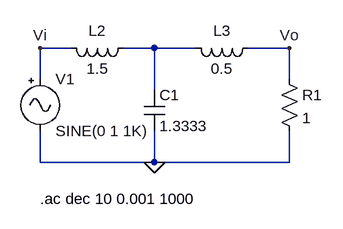
[diagram p0: schematic TS8 Ej1.asc]
TS8 Ej1.asc, the LTspice schematic file:
Version 4
SHEET 1 880 680
WIRE 256 288 208 288
WIRE 384 288 336 288
WIRE 448 288 384 288
WIRE 592 288 528 288
WIRE 208 336 208 288
WIRE 592 336 592 288
WIRE 384 352 384 288
WIRE 208 464 208 416
WIRE 384 464 384 416
WIRE 384 464 208 464
WIRE 592 464 592 416
WIRE 592 464 384 464
FLAG 384 464 0
FLAG 208 288 Vi
FLAG 592 288 Vo
SYMBOL Ind 352 272 R90
WINDOW 0 5 56 VBottom 2
WINDOW 3 32 56 VTop 2
SYMATTR InstName L2
SYMATTR Value 1.5
SYMBOL Ind 544 272 R90
WINDOW 0 5 56 VBottom 2
WINDOW 3 32 56 VTop 2
SYMATTR InstName L3
SYMATTR Value 0.5
SYMBOL Cap 368 352 R0
SYMATTR InstName C1
SYMATTR Value 1.3333
SYMBOL Res 576 320 R0
SYMATTR InstName R1
SYMATTR Value 1
SYMBOL Misc/signal 208 320 R0
SYMATTR InstName V1
SYMATTR Value2 AC 1
TEXT 208 520 Left 2 !.ac dec 10 0.001 1000

The netlist it stands for:
* TS8 Ej1.asc
L2 N001 Vi 1.5
L3 Vo N001 0.5
C1 N001 0 1.3333
R1 Vo 0 1
V1 Vi 0 SINE(0 1 1K) AC 1
.ac dec 10 0.001 1000
.backanno
.end